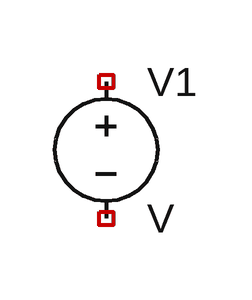
[diagram p0: schematic Draft3.asc]
Draft3.asc, the LTspice schematic file:
Version 4
SHEET 1 880 680
SYMBOL voltage 512 80 R0
SYMATTR InstName V1

The netlist it stands for:
* Draft3.asc
V1 NC_01 NC_02 V
.backanno
.end